# Altium schematic sheet Power.SchDoc
size A4; SheetNumber: 4; SheetTotal: 9
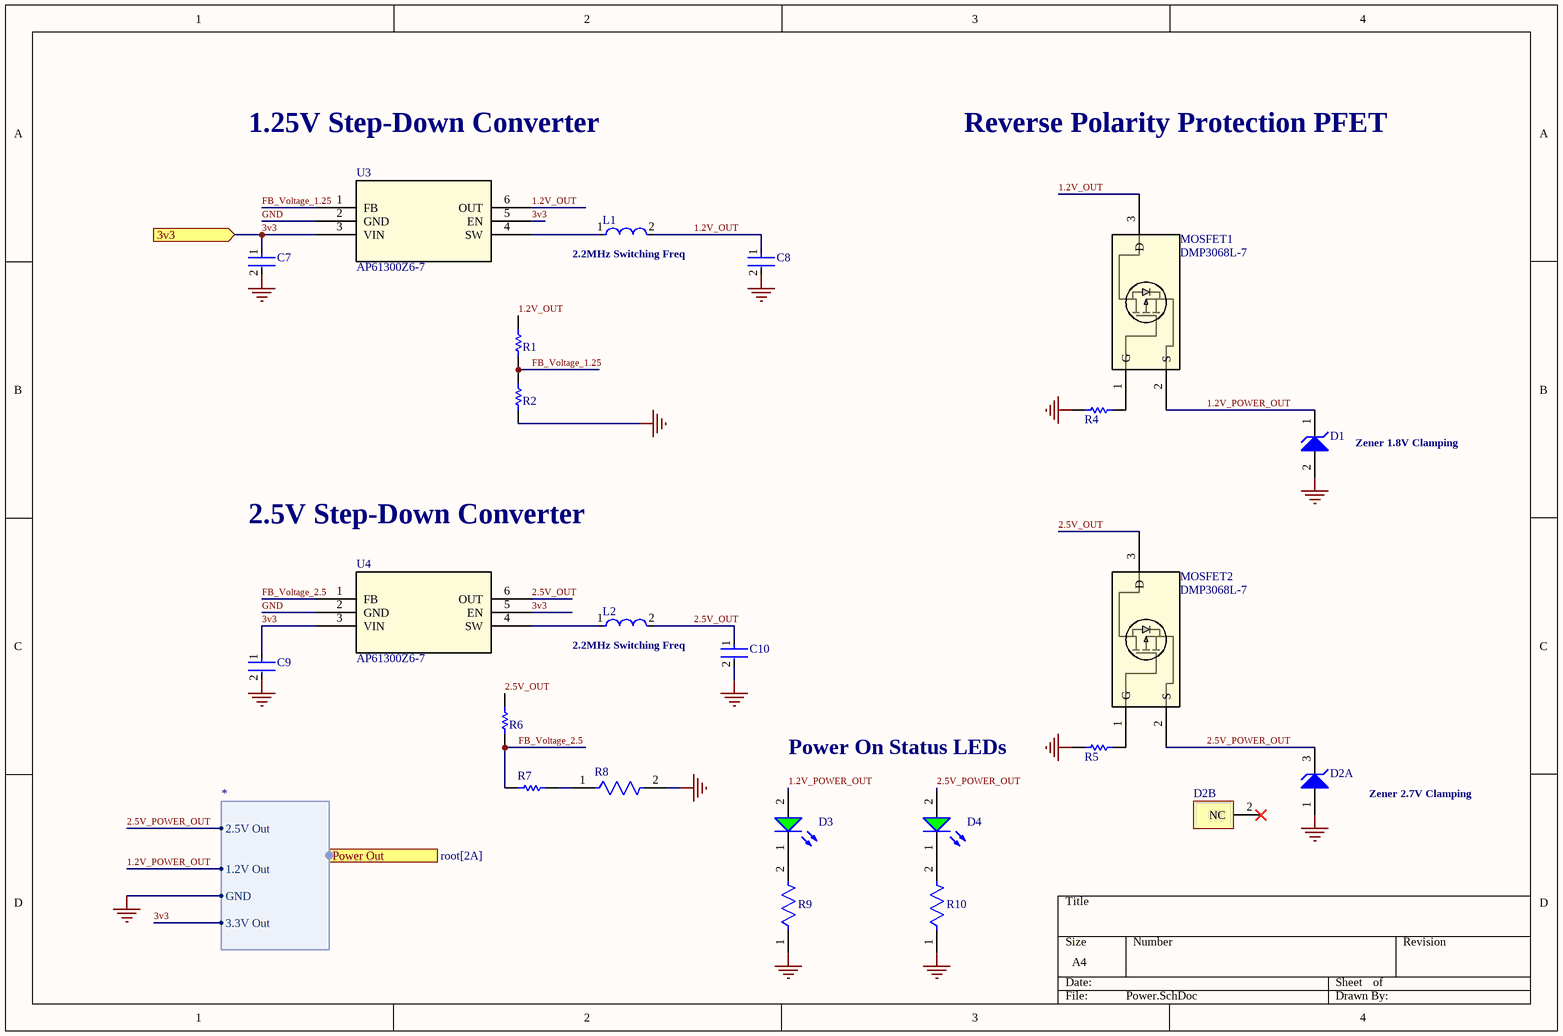
[diagram p0: Power.SchDoc]

## Parts
C7  GRT21BR61E226ME13L  [FP-GRT21B-0_2-IPC_C]  (value not drawn)
C8  GRT21BR61E226ME13L  [FP-GRT21B-0_2-IPC_C]  (value not drawn)
C9  GRT21BR61E226ME13L  [FP-GRT21B-0_2-IPC_C]  (value not drawn)
C10  GRT21BR61E226ME13L  [FP-GRT21B-0_2-IPC_C]  (value not drawn)
D1  SZMMSZ4678T1G  [ONSC-SOD-123-2-425-04_V]  (value not drawn)
D2  MMBZ5223BLT1G  [ONSC-SOT-23-3-318-08_V]  (value not drawn)  (parts A,B of 2)
D3  150060VS75000  [WL-SMCW_0603_150060xx75000]  (value not drawn)
D4  150060VS75000  [WL-SMCW_0603_150060xx75000]  (value not drawn)
L1  MLP2012H2R2MT0S1  [FP-MLP2012M-IPC_C]  (value not drawn)
L2  MLP2012H2R2MT0S1  [FP-MLP2012M-IPC_C]  (value not drawn)
MOSFET1  DMP3068L-7  [SOT-23_DMP3068L_DIO]
MOSFET2  DMP3068L-7  [SOT-23_DMP3068L_DIO]
R1  ERJ-2RKF2003X  [RESC1005X40X25NL05T05]  (value not drawn)
R2  RC0402FR-07100KL  [RESC1005X40X25NL05T10]  (value not drawn)
R4  RC0402FR-07100KL  [RESC1005X40X25NL05T10]  (value not drawn)
R5  RC0402FR-07100KL  [RESC1005X40X25NL05T10]  (value not drawn)
R6  ERJ-2RKF2003X  [RESC1005X40X25NL05T05]  (value not drawn)
R7  RC0402FR-0744K2L  [RESC1005X40X25NL05T10]  (value not drawn)
R8  RC0402FR-0720KL  [FP-RC0402-0_4-MFG]  (value not drawn)
R9  RC0603FR-0710KL  [FP-RC0603-0_55-IPC_C]  (value not drawn)
R10  RC0603FR-0710KL  [FP-RC0603-0_55-IPC_C]  (value not drawn)
U3  AP61300Z6-7  [AP61300Z6-7_DIO]
U4  AP61300Z6-7  [AP61300Z6-7_DIO]

## Ports
3v3 (in, see root[2A]), Power Out (harness *, see root[2A])

## Harnesses
*: 2.5V Out, 1.2V Out, GND, 3.3V Out

## Nets
GND: C7.2 C8.2 C9.2 C10.2 D1.2(A) D2.1(A) R2.2 R4.2 R5.2 R8.2 R9.1 R10.1 U3.2(GND) U4.2(GND) ; port Power Out.GND
1.2V_OUT: C8.1 L1.2 MOSFET1.3(D) R1.1 U3.6(OUT)
1.2V_POWER_OUT: D1.1(K) D3.2(A) MOSFET1.2(S) ; port Power Out.1.2V Out
2.5V_OUT: C10.1 L2.2 MOSFET2.3(D) R6.1 U4.6(OUT)
2.5V_POWER_OUT: D2.3(K) D4.2(A) MOSFET2.2(S) ; port Power Out.2.5V Out
3v3: C7.1 C9.1 U3.3(VIN) U3.5(EN) U4.3(VIN) U4.5(EN) ; port 3v3, port Power Out.3.3V Out
FB_Voltage_1.25: R1.2 R2.1 U3.1(FB)
FB_Voltage_2.5: R6.2 R7.1 U4.1(FB)
NetD3_1: D3.1(K) R9.2
NetD4_1: D4.1(K) R10.2
NetL1_1: L1.1 U3.4(SW)
NetL2_1: L2.1 U4.4(SW)
NetMOSFET1_1: MOSFET1.1(G) R4.1
NetMOSFET2_1: MOSFET2.1(G) R5.1
NetR7_2: R7.2 R8.1

Not connected (* = marked no-connect by the designer): D2 2(NC)*

## Notes on the sheet
- 1.25V Step-Down Converter
- Reverse Polarity Protection PFET
- (near L1) 2.2MHz Switching Freq
- (near D1) Zener 1.8V Clamping
- 2.5V Step-Down Converter
- (near L2) 2.2MHz Switching Freq
- Power On Status LEDs
- Zener 2.7V Clamping

## Library data of the parts
C7-C10 = CMP-06035-011672-1: Multi-Layer Ceramic Capacitor 22uF 25V X5R ±20% 0805 Emboss T/R; Mount: Surface Mount; Case/Package: 0805; Min Operating Temperature: -55°C; Thickness: 0.057inch; Max Operating Temperature: 85°C; Case Code (Imperial): 0805; Voltage Rating: 25V; Length: 0.079inch; Ratings: AEC-Q200; Case Code (Metric): 2012; Capacitance: 22uF; Width: 0.049inch; Packaging: Tape and Reel; Tolerance: 20%
D1 = CMP-1060-00510-1: Zener Voltage Regulator, 500 mW, 2-Pin SOD-123, Pb-Free, Tape and Reel; Manufacturer: On Semiconductor; VZ Typ (V): 1.8; P Max (W): 0.5; PartNumber: SZMMSZ4678T1G; PackageDescription: 2-Pin SOD, Body 1.6 x 2.69 mm; Mounting Technology: Surface Mount; ComponentLink2URL: http://www.onsemi.com/pub_link/Collateral/MMSZ4678T1-D.PDF; ComponentLink1URL: http://www.onsemi.com/; DatasheetVersion: Rev. 9; PackageVersion: Rev. G, 10/2009; ComponentLink3Description: Package Specification; ComponentLink2Description: Datasheet; Packing: Tape and Reel; ComponentLink3URL: http://www.onsemi.com/pub_link/Collateral/425-04.PDF; RoHS: Pb-Free; PackageReference: SOD-123-2-425-04; ComponentLink1Description: Manufacturer URL
D2 = CMP-1060-01004-1: Zener Voltage Regulator, 225 mW, 3-Pin SOT-23, Pb-Free, Tape and Reel; Manufacturer: On Semiconductor; VZ Typ (V): 2.7; DatasheetVersion: Rev. 12; ComponentLink2Description: Datasheet; PackageVersion: Rev. AP, 11/2009; RoHS: Pb-Free; Packing: Tape and Reel; PackageReference: SOT-23-3-318-08; PackageDescription: 3-Pin Small Outline Transistor, Body 2.92 x 1.3 mm, Pitch 0.95 mm; ComponentLink1URL: http://www.onsemi.com/; ComponentLink3Description: Package Specification; ComponentLink2URL: http://www.onsemi.cn/pub_link/Collateral/MMBZ5221BLT1-D.PDF; PartNumber: MMBZ5223BLT1G; Mounting Technology: Surface Mount; ComponentLink1Description: Manufacturer URL; ComponentLink3URL: http://www.onsemi.cn/pub_link/Collateral/318-08.PDF
D3 D4 = CMP-1426-00006-7: WURTH ELEKTRONIK - 150060VS75000 - LED, Green, SMD, 0603, 30 mA, 2 V, 570 nm; Reverse Voltage: 5V; Power Dissipation: 72mW; Dominant Wavelength: 570nm; Peak Wavelength: 572nm; Forward Current: 100mA; Forward Voltage: 2V; Lens Style: Clear, Rectangular; Test Current: 20mA; Max Junction Temperature (Tj): 95°C; Viewing Angle: 140°; Luminous Intensity: 40mcd; Height: 700µm; Width: 800µm; Length: 1.6mm; Mount: Surface Mount; Min Operating Temperature: -40°C; Max Reverse Voltage (DC): 5V; Case Code (Imperial): 0603; Wavelength: 570nm; Color: Green; REACH SVHC: Unknown; RoHS: Compliant; Max Operating Temperature: 85°C; Packaging: Tape and Reel; Case/Package: 0603; Number of Pins: 2; Case Code (Metric): 1608
L1 L2 = CMP-08253-000154-1: Shielded Multilayer Inductor 2.2uH ±20% 1000mA 195mΩ SMD 0805; DC Resistance (DCR): 195mR; Core Material: Ferrite; Test Frequency: 2MHz; Current Rating: 1A; Packaging: Tape and Reel; Length: 0.079inch; Tolerance: 20%; Case/Package: 0805; Case Code (Imperial): 0805; Min Operating Temperature: -40°C; Inductance: 2.2uH; Case Code (Metric): 2012; Shielding: Shielded; Mount: Surface Mount; Lead Free: Lead Free; Height - Seated (Max): 0.039inch; Max Operating Temperature: 125°C; RoHS Compliant: Yes; Package Quantity: 4000; Width: 0.049inch
MOSFET1 MOSFET2 = DMP3068L-7: No Description Available; Manufacturer_Name: Diodes Inc; Copyright: Copyright (C) 2025 Ultra Librarian. All rights reserved.; Manufacturer_Part_Number: DMP3068L-7; RefDes: RefDes; Type: Type
R1 R6 = CMP-1011-00768-4: Chip Resistor, 200 KOhm, +/- 1%, 100 mW, -55 to 155 degC, 0402 (1005 Metric), RoHS, Tape and Reel; Manufacturer: Basic Passives; Case\/Package: 0402; Voltage Rating: 50 V; Power Rating: 100 mW; RoHSCompliant: true; Length: 1 mm; DatasheetVersion: 04/2015; ComponentLink2URL: http://industrial.panasonic.com/cdbs/www-data/pdf/RDA0000/AOA0000C86.pdf; Mount: Surface Mount; PackageDescription: 2-Pin Surface Mount Device, Body 1 x 0.5 mm; PartNumber: ERJ-2RKF2003X; Tolerance: 1%; Width: 0.5 mm; ComponentLink2Description: Datasheet; Packaging: Tape and Reel; REACH SVHC: No SVHC; Min Operating Temperature: -55 degC; Package Quantity: 10000; ComponentLink1Description: Manufacturer URL; Height: 0.35 mm; ComponentLink1URL: http://www.panasonic.com/; Mounting Technology: Surface Mount; Case Code (Imperial): 0402; PackageReference: 0402; Radiation Hardening: No; Pins: 2; Max Operating Temperature: 155 degC; Resistance: 200 KOhm; Case Code (Metric): 1005
R2 R4 R5 = CMP-2002-07343-1: Manufacturer: Yageo / Phycomp; Part Number: RC0402FR-07100KL
R7 = CMP-2002-07122-1: Manufacturer: Yageo / Phycomp; Part Number: RC0402FR-0744K2L
R8 = CMP-2002-07501-2: NexarPartId: 39794396; Resistance: 20kΩ; Max Power Dissipation: 63mW; Voltage Rating: 50V; Temperature Coefficient: 100ppm/°C; Power Rating: 62.5mW; Tolerance: 1%; Termination: SMD/SMT; Features: Moisture Resistant; Max Operating Temperature: 155°C; Number of Pins: 2; Length: 1mm; Min Operating Temperature: -55°C; RoHS: Compliant; Width: 500µm; Composition: Thick Film; Case/Package: 0402; Depth: 500µm; Lead Free: Lead Free; Height: 350µm; Packaging: Tape & Reel; Military Standard: Not; Case Code (Imperial): 0402; Case Code (Metric): 1005; Schedule B: 8533210045, 8533210045; Number of Terminations: 2; Voltage Rating (DC): 50V; REACH SVHC: No SVHC
R9 R10 = CMP-2100-03664-2: RES 10K OHM 1% 1/10W 0603; Voltage Rating: 75V; Voltage Rating (DC): 50V; Resistance: 10kR; Power Rating: 100mW; Temperature Coefficient: 100ppm/°C; Depth: 0.8mm; Termination: SMD/SMT; Resistor Type: Thick Film; Series: RC; Construction: Rectangular; Features: Moisture Resistant; Packaging: Tape and Reel; Min Operating Temperature: -55°C; Number of Terminations: 2; Lead Pitch: 0.3mm; RoHS Compliant: Yes; Case/Package: 0603; Resistance Tolerance: 1%; Military Standard: Not; Weight: 7.1E-05oz; Number of Pins: 2; Tolerance: 1%; Length: 1.6mm; Case Code (Imperial): 0603; Lead Free: Lead Free; Width: 0.8mm; Max Power Dissipation: 100mW; Height: 0.45mm; Max Operating Temperature: 155°C; Case Code (Metric): 1608; Size Code: 0603
U3 U4 = AP61300Z6-7: No Description Available; Manufacturer_Name: Diodes Inc; Copyright: Copyright (C) 2025 Ultra Librarian. All rights reserved.; Manufacturer_Part_Number: AP61300Z6-7; RefDes: RefDes; Type: Type